# EAGLE design LP38693 5V LDO breakout (EAGLE 9.3.2)
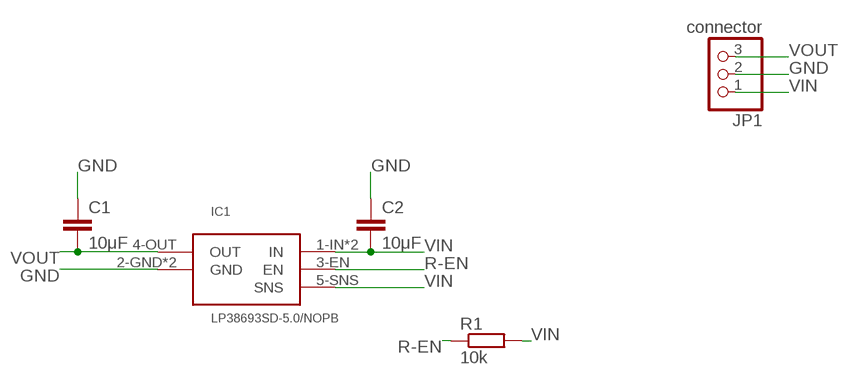
[diagram p0: schematic, sheet 1]

## Parts
C1  10μF  C-EUC0402  [C0402]
C2  10μF  C-EUC0402  [C0402]
IC1  LP38693SD-5.0/NOPB  LP38693  [WSON6]
JP1  connector  PINHD-1X3  [1X03]
R1  10k  R-EU_R0402  [R0402]

## Nets
GND: C1.1 C2.1 IC1.2-GND(GND) IC1.GND1(GND) JP1.2
R-EN: IC1.3-EN(EN) R1.1
VIN: C2.2 IC1.1-IN(IN) IC1.5-SNS(SNS) IC1.6-IN(IN) JP1.1 R1.2
VOUT: C1.2 IC1.4-OUT(OUT) JP1.3

## Library data of the parts
C1 C2 = rcl:C-EU: CAPACITOR, European symbol; SPICEPREFIX: C
IC1 = LP38693 5V LDO:LP38693
JP1 = adafruit:PINHD-1X3: PIN HEADER
R1 = rcl:R-EU_: RESISTOR, European symbol; SPICEPREFIX: R

## Board
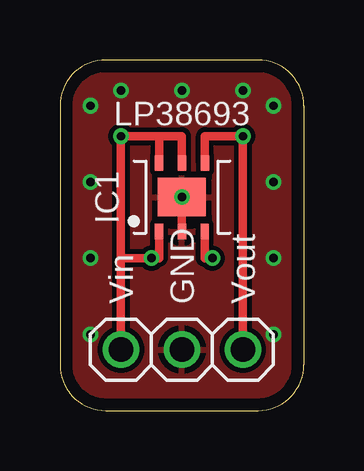
[diagram p1: board, top side]
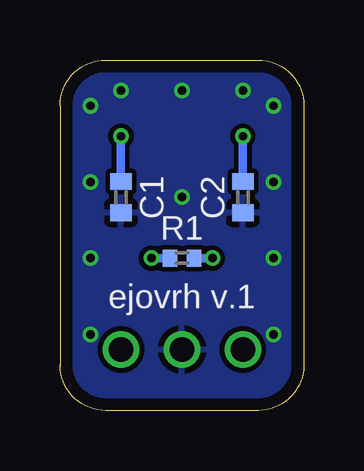
[diagram p2: board, bottom side, seen from below]

Size 10.16 x 14.61 mm. Coordinates in mm from the lower left corner, seen from the top.
Outline: 1.91,0 8.26,0 arc90 10.16,1.91 10.16,12.7 arc90 8.26,14.61 1.91,14.61 arc90 0,12.7 0,1.91 arc90 1.91,0
Copper layers (1*16): Top 0.035mm / dielectric 1.5mm / Bottom 0.035mm
Design rules "markovac_2layer": minimum track width 0.2mm, minimum drill 0.35mm, track to track 0.2mm, track to pad 0.2mm, pad to pad 0.2mm, via to via 0.2mm, smd to smd 0.2mm, copper to edge 0.5mm, drill to drill 8mil, minimum pad ring 0.15mm, minimum via ring 0.15mm, stop-mask expansion 4mil, vias tented up to drill 0.35mm, thermal gap 10mil

### Footprints (pad centres in the part's own frame; a part is rotated, then mirrored left to right if it is on the bottom)
C0402 = smd 0.7 x 0.9: 1 -0.65,0; 2 0.65,0
WSON6 = smd 0.35 x 0.65: 1-IN -0.95,-1.431; 2-GND 0,-1.431; 3-EN 0.95,-1.431; 4-OUT 0.954,1.431; 5-SNS 0,1.431; 6-IN -0.954,1.431 | smd 2 x 1.6: GND1 0,0
1X03 = drill 1.016: 1 -2.54,0; 2 0,0; 3 2.54,0
R0402 = smd 0.6 x 0.7: 1 -0.5,0; 2 0.5,0

### Placement (x,y rotation side)
C1  7.62,8.89 90 bottom
C2  2.54,8.89 90 bottom
IC1  5.08,8.89 0 top
JP1  5.08,2.54 0 top
R1  5.08,6.35 0 bottom

### Tracks (layer width: path | path; a pad name or v marks a point on that pad's centre or on a via)
GND  (via drill 0.35)
  Top 0.356: IC1.2-GND IC1.GND1
  other vias: 5.08,13.34 2.54,13.34 7.62,13.34 8.89,12.7 1.27,12.7 1.27,9.53 1.27,6.35 1.27,3.17 8.89,3.17 8.89,6.35 8.89,9.53 5.08,8.89
  pour Bottom: 0,14.61 10.16,14.61 10.16,0 0,0
  pour Top: 0,0 0,14.61 10.16,14.61 10.16,0
R-EN  (via drill 0.35)
  Top 0.356: v6.35,6.35 6.03,6.35 IC1.3-EN
  Bottom 0.356: R1.1 v6.35,6.35
VIN  (via drill 0.35)
  Top 0.356: IC1.1-IN 4.13,6.35 v3.81,6.35 2.54,6.35 | 4.13,11.43 v2.54,11.43 2.54,6.35 | 4.13,11.43 IC1.6-IN | 4.13,11.43 5.08,11.43 IC1.5-SNS | 2.54,6.35 JP1.1
  Bottom 0.356: v2.54,11.43 C2.2 | v3.81,6.35 R1.2
VOUT  (via drill 0.35)
  Top 0.356: IC1.4-OUT 6.03,11.43 v7.62,11.43 JP1.3
  Bottom 0.356: C1.2 v7.62,11.43

### Text on the board
tNames: LP38693 | Vin | GND | Vout
bNames: ejovrh v.1